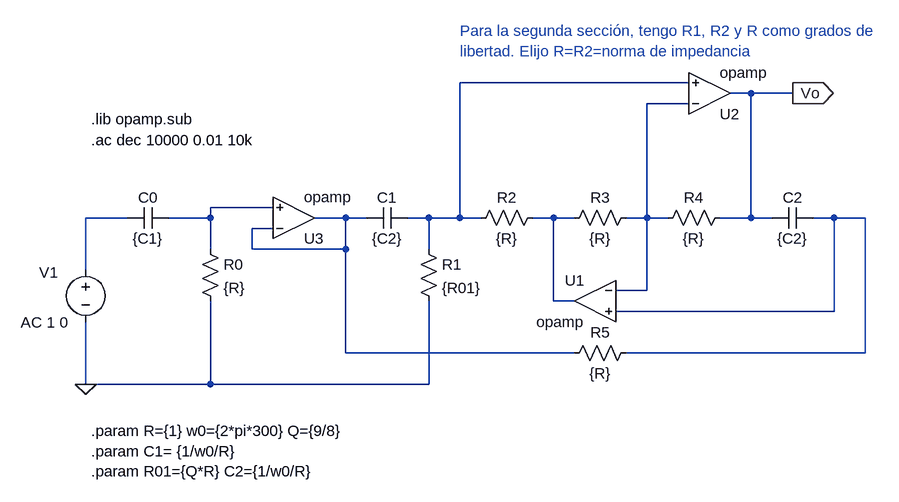
[diagram p0: schematic pasaalto_notch.asc]
pasaalto_notch.asc, the LTspice schematic file:
Version 4
SHEET 1 1396 680
WIRE 896 -48 544 -48
WIRE 992 -32 960 -32
WIRE 1056 -32 992 -32
WIRE 896 -16 832 -16
WIRE 256 144 160 144
WIRE 32 160 -32 160
WIRE 160 160 160 144
WIRE 160 160 96 160
WIRE 368 160 320 160
WIRE 400 160 368 160
WIRE 496 160 464 160
WIRE 544 160 544 -48
WIRE 544 160 496 160
WIRE 576 160 544 160
WIRE 688 160 656 160
WIRE 720 160 688 160
WIRE 832 160 832 -16
WIRE 832 160 800 160
WIRE 864 160 832 160
WIRE 992 160 992 -32
WIRE 992 160 944 160
WIRE 1024 160 992 160
WIRE 1120 160 1088 160
WIRE 1168 160 1120 160
WIRE 256 176 224 176
WIRE 160 208 160 160
WIRE 224 208 224 176
WIRE 368 208 368 160
WIRE 368 208 224 208
WIRE 496 208 496 160
WIRE -32 240 -32 160
WIRE 832 272 832 160
WIRE 832 272 784 272
WIRE 688 288 688 160
WIRE 720 288 688 288
WIRE 1120 304 1120 160
WIRE 1120 304 784 304
WIRE 368 368 368 208
WIRE 720 368 368 368
WIRE 1168 368 1168 160
WIRE 1168 368 800 368
WIRE -32 416 -32 320
WIRE 160 416 160 288
WIRE 160 416 -32 416
WIRE 496 416 496 288
WIRE 496 416 160 416
FLAG 1056 -32 Vo
IOPIN 1056 -32 Out
FLAG -32 416 0
SYMBOL cap 96 144 R90
WINDOW 0 0 32 VBottom 2
WINDOW 3 32 32 VTop 2
SYMATTR InstName C0
SYMATTR Value {C1}
SYMBOL res 144 192 R0
SYMATTR InstName R0
SYMATTR Value {R}
SYMBOL cap 464 144 R90
WINDOW 0 0 32 VBottom 2
WINDOW 3 32 32 VTop 2
SYMATTR InstName C1
SYMATTR Value {C2}
SYMBOL res 480 192 R0
SYMATTR InstName R1
SYMATTR Value {R01}
SYMBOL res 816 352 R90
WINDOW 0 0 56 VBottom 2
WINDOW 3 32 56 VTop 2
SYMATTR InstName R5
SYMATTR Value {R}
SYMBOL res 672 144 R90
WINDOW 0 0 56 VBottom 2
WINDOW 3 32 56 VTop 2
SYMATTR InstName R2
SYMATTR Value {R}
SYMBOL res 816 144 R90
WINDOW 0 0 56 VBottom 2
WINDOW 3 32 56 VTop 2
SYMATTR InstName R3
SYMATTR Value {R}
SYMBOL res 960 144 R90
WINDOW 0 0 56 VBottom 2
WINDOW 3 32 56 VTop 2
SYMATTR InstName R4
SYMATTR Value {R}
SYMBOL cap 1088 144 R90
WINDOW 0 0 32 VBottom 2
WINDOW 3 32 32 VTop 2
SYMATTR InstName C2
SYMATTR Value {C2}
SYMBOL OpAmps\\opamp 752 224 M0
SYMATTR InstName U1
SYMBOL OpAmps\\opamp 928 32 M180
SYMATTR InstName U2
SYMBOL voltage -32 224 R0
WINDOW 0 -72 20 Left 2
WINDOW 123 -100 97 Left 2
WINDOW 39 0 0 Left 0
SYMATTR InstName V1
SYMATTR Value ""
SYMATTR Value2 AC 1 0
SYMBOL OpAmps\\opamp 288 224 M180
SYMATTR InstName U3
TEXT -24 8 Left 2 !.lib opamp.sub
TEXT -24 40 Left 2 !.ac dec 10000 0.01 10k
TEXT -24 488 Left 2 !.param R={1} w0={2*pi*300} Q={9/8}\n.param C1= {1/w0/R}\n.param R01={Q*R} C2={1/w0/R}
TEXT 544 -128 Left 2 ;Para la segunda sección, tengo R1, R2 y R como grados de\nlibertad. Elijo R=R2=norma de impedancia

The netlist it stands for:
* pasaalto_notch.asc
C0 N003 N004 {C1}
R0 N003 0 {R}
C1 N001 N005 {C2}
R1 N001 0 {R01}
R5 N007 N005 {R}
R2 N006 N001 {R}
R3 N002 N006 {R}
R4 Vo N002 {R}
C2 N007 Vo {C2}
XU1 N002 N007 N006 opamp Aol=100K GBW=10Meg  ; pins invin noninvin out
XU2 N002 N001 Vo opamp Aol=100K GBW=10Meg  ; pins invin noninvin out
V1 N004 0 AC 1 0
XU3 N005 N003 N005 opamp Aol=100K GBW=10Meg  ; pins invin noninvin out
.lib opamp.sub
.ac dec 10000 0.01 10k
.param R={1} w0={2*pi*300} Q={9/8}
.param C1= {1/w0/R}
.param R01={Q*R} C2={1/w0/R}
* Para la segunda sección, tengo R1, R2 y R como grados de
* libertad. Elijo R=R2=norma de impedancia
.backanno
.end